# EAGLE design EyeControl (EAGLE 7.5.0)
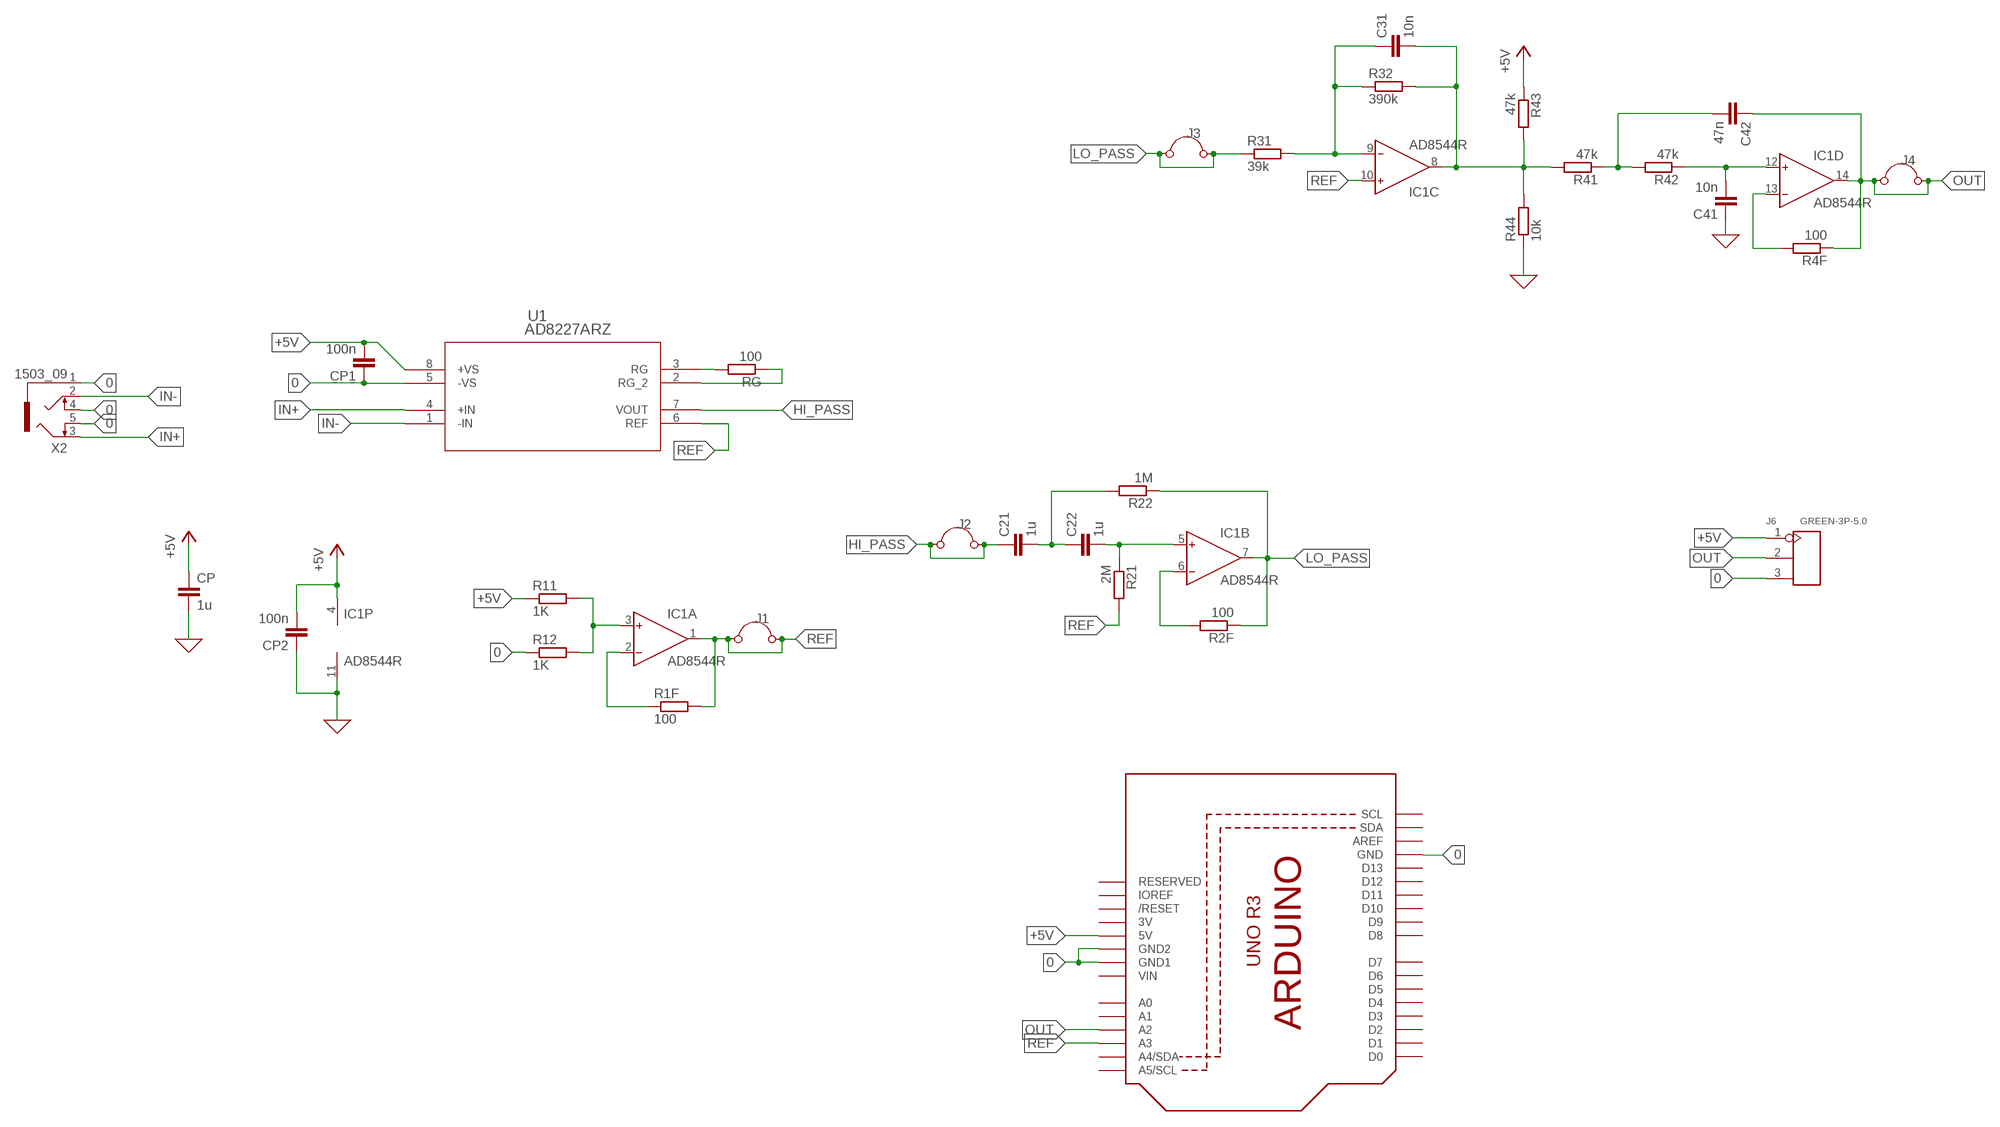
[diagram p0: schematic, sheet 1]

## Parts
C21  1u  C  [C0805]
C22  1u  C  [C0805]
C31  10n  C  [C0805]
C41  10n  C  [C0805]
C42  47n  C  [C0805]
CP  1u  C  [C0805]
CP1  100n  C  [C0805]
CP2  100n  C  [C0805]
IC1  AD8544R  [SO14]
J1  JUMPER  [05]
J2  JUMPER  [05]
J3  JUMPER  [05]
J4  JUMPER  [05]
J6  GREEN-3P-5.0  SCREW-TERMINAL-GREEN(3P-5.0)  [H3-5.0-15.5X8.0MM]
R1F  100  RR1206  [R1206]
R2F  100  RR1206  [R1206]
R4F  100  RR1206  [R1206]
R11  1K  RR1206  [R1206]
R12  1K  RR1206  [R1206]
R21  2M  RR1206  [R1206]
R22  1M  RR1206  [R1206]
R31  39k  RR1206  [R1206]
R32  390k  RR1206  [R1206]
R41  47k  RR1206  [R1206]
R42  47k  RR1206  [R1206]
R43  47k  RR1206  [R1206]
R44  10k  RR1206  [R1206]
RG  100  RR1206  [R1206]
U1  AD8227ARZ  [R_8]
U$1  ARDUINOR3-DIMENSION  [ARDUINOR3]
X2  1503_09  [1503_09]

## Nets
0: C41.1 CP1.1 CP2.1 CP.2 IC1.11(P:V-) J6.3 R12.1 R44.1 U1.5(-VS) U$1.GND U$1.GND1 U$1.GND2 X2.1 X2.4 X2.5
+5V: CP1.2 CP2.2 CP.1 IC1.4(P:V+) J6.1 R11.1 R43.1 U1.8(+VS) U$1.5V
HI_PASS: C21.1 J2.1(+) J2.2(-) U1.7(VOUT)
IN+: U1.4(+IN) X2.3
IN-: U1.1(-IN) X2.2
LO_PASS: IC1.7(B:OUT) J3.1(+) J3.2(-) R2F.1 R22.1 R31.1
N$1: C31.1 IC1.9(C:IN-) R31.2 R32.1
N$2: C41.2 IC1.12(D:IN+) R42.1
N$3: IC1.2(A:IN-) R1F.1
N$4: IC1.3(A:IN+) R11.2 R12.2
N$5: C42.2 R41.1 R42.2
N$6: C21.2 C22.1 R22.2
N$7: RG.1 U1.2(RG_2)
N$8: RG.2 U1.3(RG)
N$9: C22.2 IC1.5(B:IN+) R21.1
N$10: C31.2 IC1.8(C:OUT) R32.2 R41.2 R43.2 R44.2
N$12: IC1.6(B:IN-) R2F.2
N$16: IC1.13(D:IN-) R4F.2
OUT: C42.1 IC1.14(D:OUT) J4.1(+) J4.2(-) J6.2 R4F.1 U$1.A2
REF: IC1.1(A:OUT) IC1.10(C:IN+) J1.1(+) J1.2(-) R1F.2 R21.2 U1.6(REF) U$1.A3
Unconnected: U$1.A0 U$1.A1 U$1.A4(A4/SDA) U$1.A5(A5/SCL) U$1.AREF U$1.D0 U$1.D1 U$1.D2 U$1.D3 U$1.D4 U$1.D5 U$1.D6 U$1.D7 U$1.D8 U$1.D9 U$1.D10 U$1.D11 U$1.D12 U$1.D13 U$1.IOREF U$1.RESERVED U$1.RESET(/RESET) U$1.SCL U$1.SDA

## Power pins joined to a net without a drawn wire
3V: U$1.3V
VIN: U$1.VIN

## Library data of the parts
C21 C22 C31 C41 C42 CP CP1 CP2 = eagle-ltspice:C: CAPACITOR, European symbol; SPICEMODEL: NONE; SPICEPREFIX: C
IC1 = analog-devices:AD8544: General-Purpose CMOS Rail-to-Rail Amplifiers Source: http://www.analog.com/static/imported-files/data_sheets/AD8541_8542_8544.pdf; MPN: AD8544ARZ; OC_FARNELL: 9425748; OC_NEWARK: 19M0966; SPICEMODEL: AD8544; SPICEPREFIX: none
J1-J4 = Misc:JUMPER: A wire jumper. This component lets you give the same net two different names
J6 = Seeed-OPL-Connector:SCREW-TERMINAL-GREEN(3P-5.0): 320110029
R1F R2F R4F R11 R12 R21 R22 R31 R32 R41-R44 RG = eagle-ltspice:R: RESISTOR, European symbol; SPICEMODEL: NONE; SPICEPREFIX: R
U1 = AD8227ARZ:AD8227ARZ; MANUFACTURER_PART_NUMBER: AD8227ARZ; VENDOR: Vendor
U$1 = adafruit:ARDUINOR3: This is a new object for the new Arduino R3 - with extra pins that you may want to use (such as IOref, and duplicated A4/A5
X2 = con-lumberg:1503_09: Jack connectors according to JISC 6560, 3.5 mm Klinkeneinbaukupplung nach JISC 6560, 3,5 mm, 3-polig/ stereo, abgewinkelte Ausführung, mit 2 Öffnern und Lötaugen, für Leiterplatten Rückseitenmontage Source: http://www.lumberg.com/Produkte/PDFs/1503_09.pdf; OC_FARNELL: 1243244; OC_NEWARK: unknown

## Board
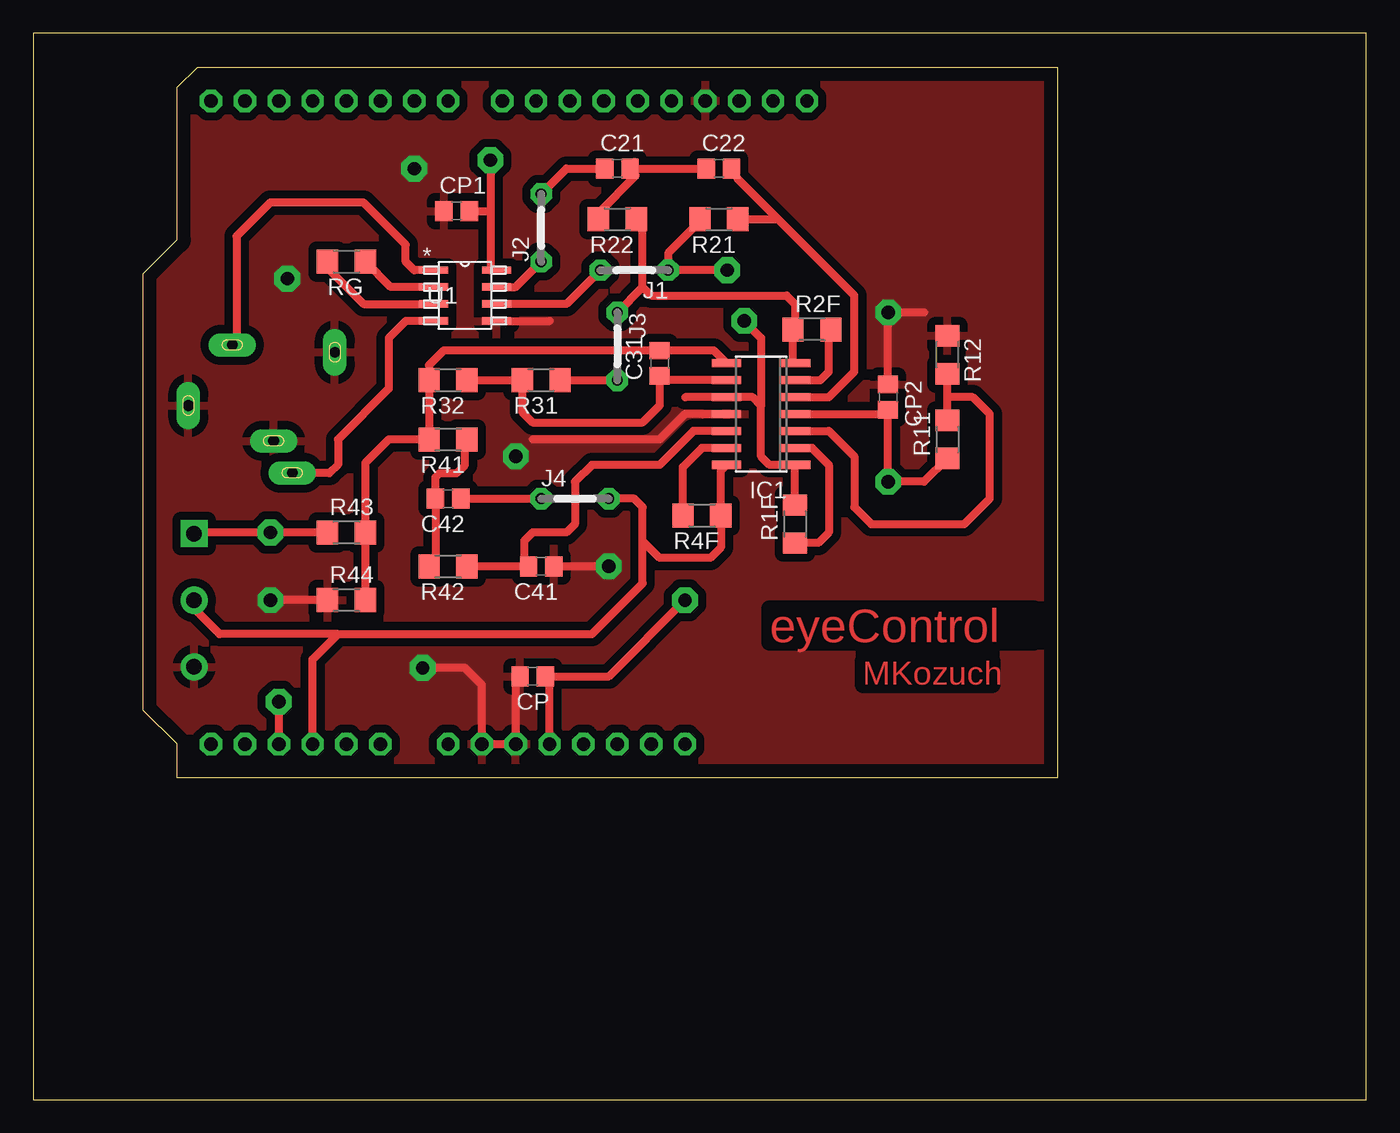
[diagram p1: board, top side]
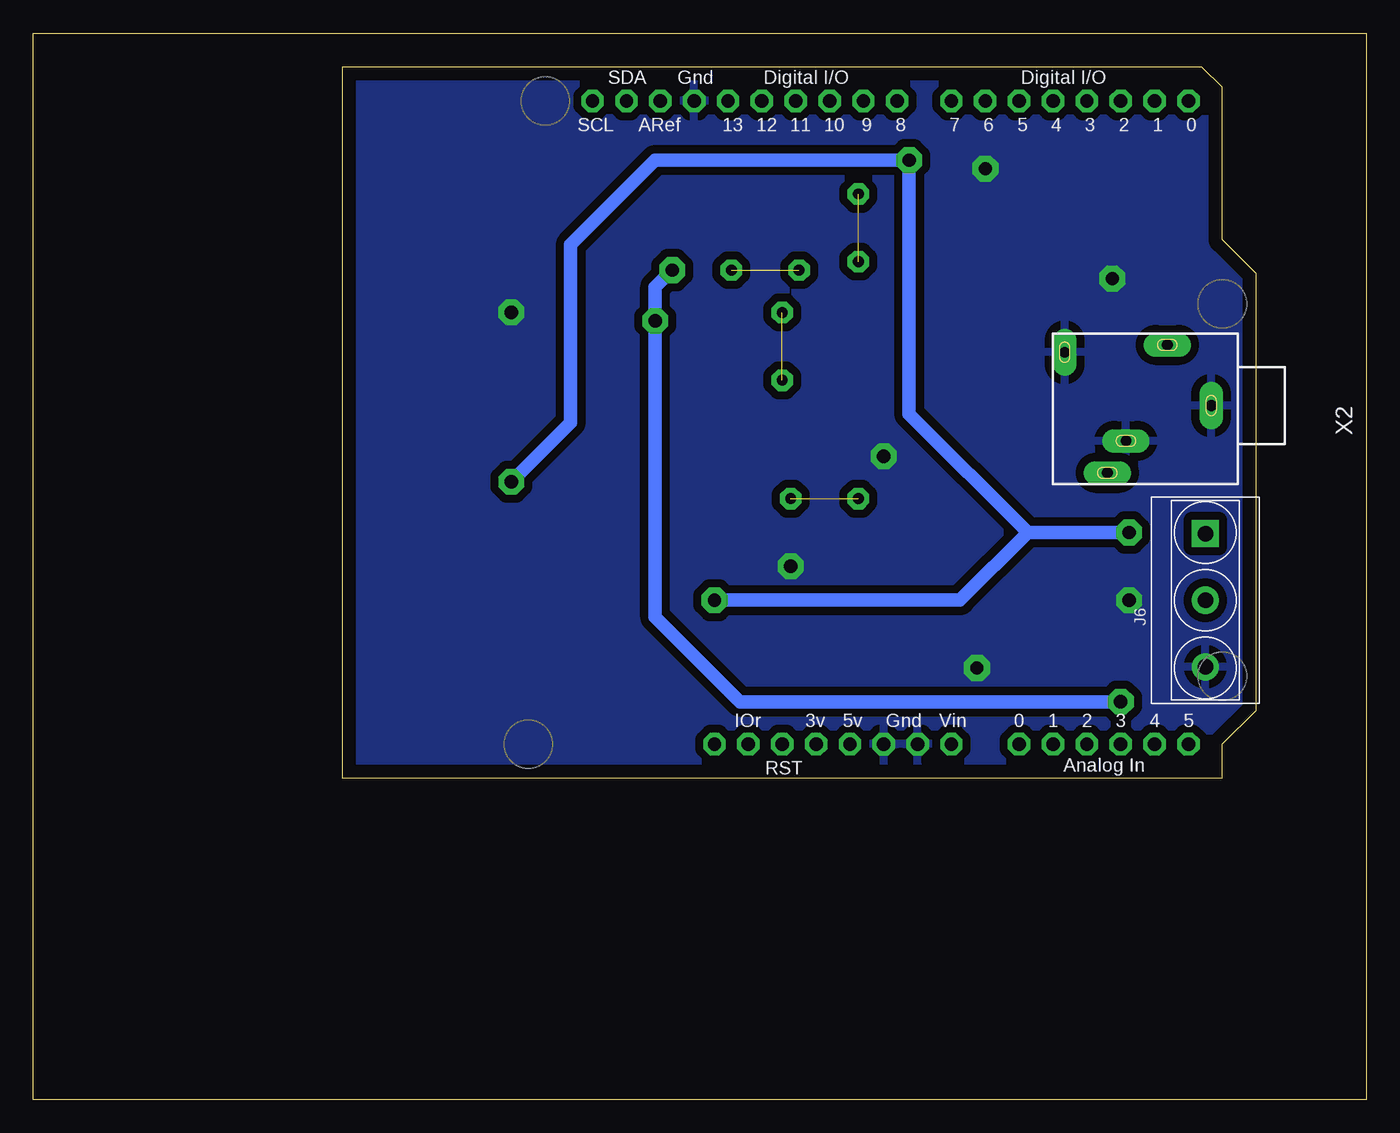
[diagram p2: board, bottom side, seen from below]

Size 100 x 80 mm. Coordinates in mm from the lower left corner, seen from the top.
Outline: 0,0 100,0 100,80 0,80 0,0
Copper layers (1*16): Top 0.035mm / dielectric 1.5mm / Bottom 0.035mm
Design rules "default *": minimum track width 10mil, minimum drill 24mil, track to track 8mil, track to pad 8mil, pad to pad 8mil, via to via 8mil, smd to smd 8mil, copper to edge 40mil, drill to drill 8mil, minimum pad ring 10mil, minimum via ring 8mil, stop-mask expansion 4mil, vias tented up to drill 0mil, thermal gap 24mil

### Footprints (pad centres in the part's own frame; a part is rotated, then mirrored left to right if it is on the bottom)
C0805 = smd 1.3 x 1.5: 1 -0.95,0; 2 0.95,0
SO14 = smd 0.6 x 2.2: 1 -3.81,-2.6; 2 -2.54,-2.6; 3 -1.27,-2.6; 4 0,-2.6; 5 1.27,-2.6; 6 2.54,-2.6; 7 3.81,-2.6; 8 3.81,2.6; 9 2.54,2.6; 10 1.27,2.6; 11 0,2.6; 12 -1.27,2.6; 13 -2.54,2.6; 14 -3.81,2.6
05 = drill 0.813 pad 1.6 octagon: 1 -2.54,0; 2 2.54,0
H3-5.0-15.5X8.0MM = drill 1.168 pad 2.032 square: 1 0,5 | drill 1.168 pad 2.032: 2 0,0; 3 0,-5
R1206 = smd 1.6 x 1.803: 1 -1.422,0; 2 1.422,0
R_8 = smd 2.184 x 0.559: 1 -2.362,1.905; 2 -2.362,0.635; 3 -2.362,-0.635; 4 -2.362,-1.905; 5 2.362,-1.905; 6 2.362,-0.635; 7 2.362,0.635; 8 2.362,1.905
ARDUINOR3 = drill 1 pad 1.676 octagon: 3V 35.56,2.54; 5V 38.1,2.54; A0 50.8,2.54; A1 53.34,2.54; A2 55.88,2.54; A3 58.42,2.54; A4 60.96,2.54; A5 63.5,2.54; AREF 23.876,50.8; D0 63.5,50.8; D1 60.96,50.8; D2 58.42,50.8; D3 55.88,50.8; D4 53.34,50.8; D5 50.8,50.8; D6 48.26,50.8; D7 45.72,50.8; D8 41.656,50.8; D9 39.116,50.8; D10 36.576,50.8; D11 34.036,50.8; D12 31.496,50.8; D13 28.956,50.8; GND 26.416,50.8; GND1 43.18,2.54; GND2 40.64,2.54; IOREF 30.48,2.54; RESERVED 27.94,2.54; RESET 33.02,2.54; SCL 18.796,50.8; SDA 21.336,50.8; VIN 45.72,2.54
1503_09 = drill 0.8 pad 1.778 long: 1 0,-2.1; 2 -4.55,-5.4; 3 5.05,-9.9; 4 -4,-13.1; 5 2.65,-8.5

### Placement (x,y rotation side)
C21  43.82,69.85 0 top
C22  51.44,69.85 0 top
C31  46.99,55.24 90 top
C41  38.1,40.01 180 top
C42  31.11,45.09 180 top
CP  37.47,31.75 180 top
CP1  31.75,66.67 0 top
CP2  64.13,52.7 270 top
IC1  54.61,51.44 90 top
J1  45.09,62.23 180 top
J2  38.1,65.41 90 top
J3  43.82,56.52 270 top
J4  40.64,45.09 0 top
J6  12.06,37.47 0 bottom
R1F  57.15,43.18 90 top
R2F  58.42,57.78 0 top
R4F  50.16,43.81 180 top
R11  68.58,49.53 90 top
R12  68.58,55.88 270 top
R21  51.44,66.04 180 top
R22  43.82,66.04 180 top
R31  38.1,53.98 180 top
R32  31.11,53.98 180 top
R41  31.11,49.53 180 top
R42  31.11,40.01 180 top
R43  23.49,42.55 0 top
R44  23.49,37.47 0 top
RG  23.49,62.87 180 top
U1  32.39,60.33 0 top
U$1  76.83,24.13 0 bottom
X2  9.53,52.07 270 bottom

### Tracks (layer width: path | path; a pad name or v marks a point on that pad's centre or on a via)
0  (via drill 1 pad 1.93)
  Top 0.61: CP.2 36.2,31.62 U$1.GND2 U$1.GND1 33.66,31.11 32.39,32.38 v29.21,32.38 | 50.16,51.44 IC1.11 48.9,51.44 46.99,49.53 37.47,49.53 | R44.1 v17.78,37.47 | CP2.1 v64.13,59.05 66.83,59.05 | v43.18,40.01 C41.1 | U1.5 38.73,58.42
  other vias: 36.2,48.26 28.57,69.85 19.05,61.59
  pour Bottom (isolate 0.61): 97.16,78.11 99.06,1.27 1.27,1.27 0.64,79.38
  pour Top (isolate 0.61): 1.27,83.19 97.79,83.19 100.33,0 0.64,0 1.91,74.93
+5V  (via drill 1 pad 1.93)
  Top 0.61: U$1.5V 38.73,31.75 CP.1 43.18,31.75 v48.9,37.47 | R43.1 v17.78,42.55 12.14,42.55 J6.1 | IC1.4 64,51.44 CP2.2 v64.13,46.35 66.83,46.35 R11.1 | v34.29,70.48 34.29,66.67 | 34.29,66.67 34.29,62.23 U1.8 | CP1.2 34.29,66.67
  Bottom 1.016: v17.78,42.55 25.4,42.55 | 25.4,42.55 34.29,51.44 v34.29,70.48 53.34,70.48 59.69,64.14 59.69,50.8 v64.13,46.35 | v48.9,37.47 30.48,37.47 25.4,42.55
HI_PASS  (1 unrouted)
  Top 0.61: U1.7 36.2,60.96 J2.1 | J2.2 40.01,69.85 C21.1
IN+
  Top 0.61: 19.42,47.37 X2.3 19.45,46.99 22.22,46.99 22.86,47.62 22.86,49.53 26.67,53.34 26.67,57.15 27.94,58.42 U1.4
IN-
  Top 0.61: X2.2 15.24,56.94 15.24,64.77 17.78,67.31 24.76,67.31 27.94,64.14 27.94,62.87 28.57,62.23 U1.1
LO_PASS  (1 unrouted)
  Top 0.61: R31.1 J3.2 | J3.1 45.72,60.96 | 45.72,60.96 45.72,65.56 R22.1 | R2F.1 57.21,58.21 | 45.72,60.96 46.36,60.33 56.52,60.33 57.15,59.69 57.15,57.94 R2F.1 | IC1.7 57,55.46 R2F.1
N$1
  Top 0.61: R32.1 R31.2 | IC1.9 47.12,53.98 C31.1 46.99,52.07 45.72,50.8 37.47,50.8 36.68,51.59 R31.2 | 36.2,53.82 R31.2
N$2
  Top 0.61: R42.1 C41.2 36.83,40.13 36.83,41.91 37.47,42.55 40.01,42.55 40.64,43.18 40.64,46.35 41.91,47.62 46.99,47.62 49.53,50.16 IC1.12
N$3
  Top 0.61: 56.67,41.76 R1F.1 58.9,41.76 59.69,42.55 59.69,47.62 58.42,48.9 IC1.2
N$4
  Top 0.61: R11.2 68.58,52.7 | 68.58,52.7 R12.2 | IC1.3 59.69,50.16 61.59,48.26 61.59,44.45 62.87,43.18 69.85,43.18 71.75,45.09 71.75,51.44 70.48,52.7 68.58,52.7
N$5
  Top 0.61: 29.71,40.03 R42.2 30.16,40.48 C42.2 30.16,46.67 30.48,46.99 31.75,46.99 32.39,47.62 32.39,49.38 R41.1
N$6
  Top 0.61: C21.2 45.09,70.36 | R22.2 42.39,66.52 45.22,69.34 C21.2 | C21.2 C22.1
N$7
  Top 0.61: U1.2 26.82,60.96 RG.1
N$8
  Top 0.61: U1.3 24.76,59.69 22.07,62.38 RG.2
N$9
  Top 0.61: IC1.5 59.69,52.7 61.59,54.61 61.59,60.33 55.88,66.04 | 55.88,66.04 52.84,69.08 C22.2 | R21.1 55.88,66.04
N$10
  Top 0.61: R44.2 R43.2 24.92,47.78 26.67,49.53 R41.2 R32.2 29.69,55.09 30.8,56.2 C31.2 51.06,56.2 IC1.8
N$12
  Top 0.61: IC1.6 59.05,53.98 59.69,54.61 59.69,57.63 R2F.2
N$16
  Top 0.61: IC1.13 50.16,48.9 48.74,47.47 R4F.2
OUT  (1 unrouted)
  Top 0.61: U$1.A2 20.95,33.02 22.86,34.92 | 22.86,34.92 41.91,34.92 45.72,38.73 45.72,41.91 | C42.1 J4.1 | 22.86,34.92 13.97,34.92 12.06,36.83 J6.2 | IC1.14 51.59,47.2 R4F.1 51.59,41.43 50.8,40.64 46.99,40.64 45.72,41.91 | 45.72,41.91 45.72,44.45 45.09,45.09 J4.2
REF  (via drill 1 pad 1.93)  (1 unrouted)
  Top 0.61: IC1.1 57.63,47.62 | R1F.2 57.15,47.56 IC1.1 | J1.2 40.01,59.69 U1.6 | IC1.1 55.25,47.62 54.61,48.26 54.61,52.07 | 54.61,52.07 53.98,52.7 IC1.10 48.9,52.7 | 54.61,52.07 54.61,57.15 v53.34,58.42 | R21.2 50.01,65.89 47.62,63.5 J1.1 v52.07,62.23 | v18.41,29.84 U$1.A3
  Bottom 1.016: v18.41,29.84 46.99,29.84 53.34,36.2 v53.34,58.42 53.34,60.96 v52.07,62.23

### Text on the board
Top: eyeControl | MKozuch